# Altium schematic sheet Boost Converter.SchDoc
size A4
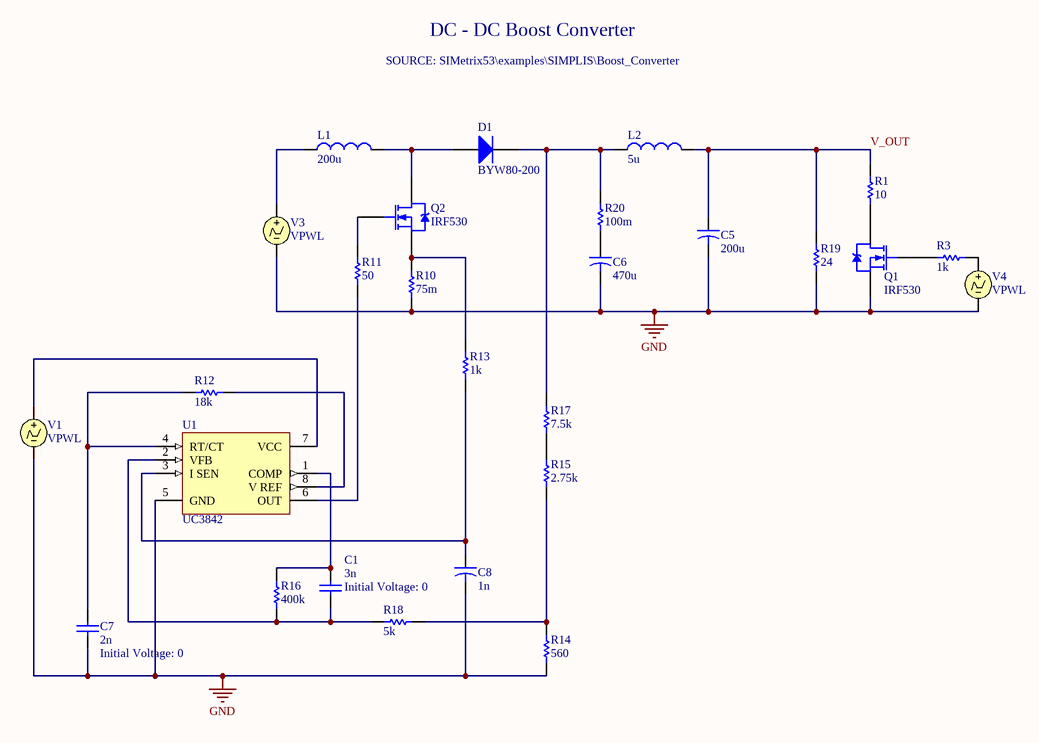
[diagram p0: Boost Converter.SchDoc]

## Parts
C1  value 3n  Initial Voltage: 0  [RAD-0.3]  (hidden comment: Cap)
C5  CC: 200u  [CAPR5-4X5]  (hidden comment: Cap Elec (L1-3))
C6  CC: 470u  [CAPR5-4X5]  (hidden comment: Cap Elec (L1-3))
C7  value 2n  Initial Voltage: 0  [RAD-0.3]  (hidden comment: Cap)
C8  CC: 1n  [CAPR5-4X5]  (hidden comment: Cap Elec (L1-3))
D1  BYW80-200  [SMC]
L1  value 200u  [0402-A]  (hidden comment: Lossy Inductor)
L2  value 5u  [0402-A]  (hidden comment: Lossy Inductor)
Q1  IRF530  [TO-220AB]
Q2  IRF530  [TO-220AB]
R1  value 10  [AXIAL-0.3]  (hidden comment: Res1)
R3  value 1k  [AXIAL-0.3]  (hidden comment: Res1)
R10  value 75m  [AXIAL-0.3]  (hidden comment: Res1)
R11  value 50  [AXIAL-0.3]  (hidden comment: Res1)
R12  value 18k  [AXIAL-0.3]  (hidden comment: Res1)
R13  value 1k  [AXIAL-0.3]  (hidden comment: Res1)
R14  value 560  [AXIAL-0.3]  (hidden comment: Res1)
R15  value 2.75k  [AXIAL-0.3]  (hidden comment: Res1)
R16  value 400k  [AXIAL-0.3]  (hidden comment: Res1)
R17  value 7.5k  [AXIAL-0.3]  (hidden comment: Res1)
R18  value 5k  [AXIAL-0.3]  (hidden comment: Res1)
R19  value 24  [AXIAL-0.3]  (hidden comment: Res1)
R20  value 100m  [AXIAL-0.3]  (hidden comment: Res1)
U1  UC3842  [SO8_L]
V1  VPWL  [HDR1X2H]
V3  VPWL  [HDR1X2H]
V4  VPWL  [HDR1X2H]

## Nets
GND: C5.2 C6.2 C7.2 C8.2 Q1.3(S) R10.1 R14.1 R19.2 U1.5(GND) V1.2 V3.2 V4.2
V_OUT: C5.1 L2.2 R1.1 R19.1
NetC1_1: C1.1 R16.2 U1.1(COMP)
NetC1_2: C1.2 R16.1 R18.2 U1.2(VFB)
NetC6_1: C6.1 R20.1
NetC7_1: C7.1 R12.2 U1.4(RT/CT)
NetC8_1: C8.1 R13.1 U1.3(I_SEN)
NetD1_1: D1.1(A) L1.2 Q2.2(D)
NetD1_2: D1.2(K) L2.1 R17.2 R20.2
NetL1_1: L1.1 V3.1
NetQ1_1: Q1.1(G) R3.1
NetQ1_2: Q1.2(D) R1.2
NetQ2_1: Q2.1(G) R11.2
NetQ2_3: Q2.3(S) R10.2 R13.2
NetR3_2: R3.2 V4.1
NetR11_1: R11.1 U1.6(OUT)
NetR12_1: R12.1 U1.8(V_REF)
NetR14_2: R14.2 R15.1 R18.1
NetR15_2: R15.2 R17.1
NetU1_7: U1.7(VCC) V1.1

## Notes on the sheet
- DC - DC Boost Converter
- SOURCE: SIMetrix53\examples\SIMPLIS\Boost_Converter

## Library data of the parts
C1 C7 = Cap: Capacitor; Published: 8-Jun-2000; LatestRevisionDate: 17-Jul-2002; LatestRevisionNote: Re-released for DXP Platform.; PackageReference: RAD-0.3; Publisher: Altium Limited
C5 = Cap Elec (L1-3): Electrolytic Capacitor (Levels 1-3); RSH_CC: 100Meg; RESR: 20m; LEVEL: 2; Published: 23-Sep-2002; PackageReference: CAPR5-4X5; Publisher: Altium Limited
C6 = Cap Elec (L1-3): Electrolytic Capacitor (Levels 1-3); LEVEL: 2; RSH_CC: 100Meg; RESR: 30m; Published: 23-Sep-2002; PackageReference: CAPR5-4X5; Publisher: Altium Limited
C8 = Cap Elec (L1-3): Electrolytic Capacitor (Levels 1-3); RSH_CC: 1G; RESR: 50; LEVEL: 2; Published: 23-Sep-2002; PackageReference: CAPR5-4X5; Publisher: Altium Limited
D1 = BYW80-200: High-Efficiency Fast Recovery Rectifier Diode; Published: 8-Jun-2000; LatestRevisionDate: 17-Jul-2002; LatestRevisionNote: Re-released for DXP Platform.; PackageDocument: Sep-1996; PackageReference: SMC; Publisher: Altium Limited; Code_JEDEC: DO-214-AB
L1 L2 = Inductor (Lossy): Code_IEC: 1005; RSERIES: 10m; RSHUNT: 1G; Published: 8-Jun-2000; LatestRevisionDate: 17-Jul-2002; LatestRevisionNote: Re-released for DXP Platform.; PackageReference: 0402-A; Publisher: Altium Limited; Code_JEITA: 0402
Q1 Q2 = IRF530: HEXFET N-Channel Power MOSFET; Note: Pin 2 is electrically connected to pin 4.; Published: 8-Jun-2000; LatestRevisionDate: 17-Jul-2002; LatestRevisionNote: Re-released for DXP Platform.; DatasheetVersion: PD-9.307O; PackageVersion: Feb-1997; PackageReference: TO-220AB; Publisher: Altium Limited; PackageDescription: TO, Thru-Hole, Vertical, Heatsink Mounted; 3 In-Line Leads; Pitch 2.54 mm; ComponentLink1Description: Manufacturer Link; ComponentLink1URL: http://www.irf.com/; ComponentLink2Description: Datasheet; ComponentLink2URL: http://www.irf.com/product-info/datasheets/data/irf530.pdf
R1 R3 R10-R20 = Res1: Resistor; Published: 8-Jun-2000; LatestRevisionDate: 17-Jul-2002; LatestRevisionNote: Re-released for DXP Platform.; PackageReference: AXIAL-0.3; Publisher: Altium Limited
U1 = UC3842: High-Performance Current Mode PWM Controller; Published: 24-Aug-2001; LatestRevisionDate: 13-Apr-2006; LatestRevisionNote: IPC-7351 Footprint Added.; DatasheetVersion: Mar-1999; PackageVersion: Dec-2002; PackageReference: SO8; Publisher: Altium Limited; PackageDescription: 8-Pin Small Outline Integrated Circuit 1.27 mm Pitch; Code_JEDEC: MS-012-AA; Code_IPC: SOIC127P600-8; ComponentLink1Description: Manufacturer Link; ComponentLink1URL: http://www.st.com/; ComponentLink2Description: Datasheet; ComponentLink2URL: http://www.st.com/stonline/products/literature/ds/4299/uc3842b.pdf
V1 V3 V4 = VPWL: Piecewise Linear Voltage Source; Note: PCB Footprint - Not required; Sim Note: To add model file containing time-current pairs of values, enter model location under "General Tab" in "Full Path" box.; Published: 8-Jun-2000; LatestRevisionDate: 17-Jul-2002; LatestRevisionNote: Re-released for DXP Platform.; PackageReference: Not Applicable; Publisher: Altium Limited